# EAGLE schematic FinalSchV3 (EAGLE 7.5.0)
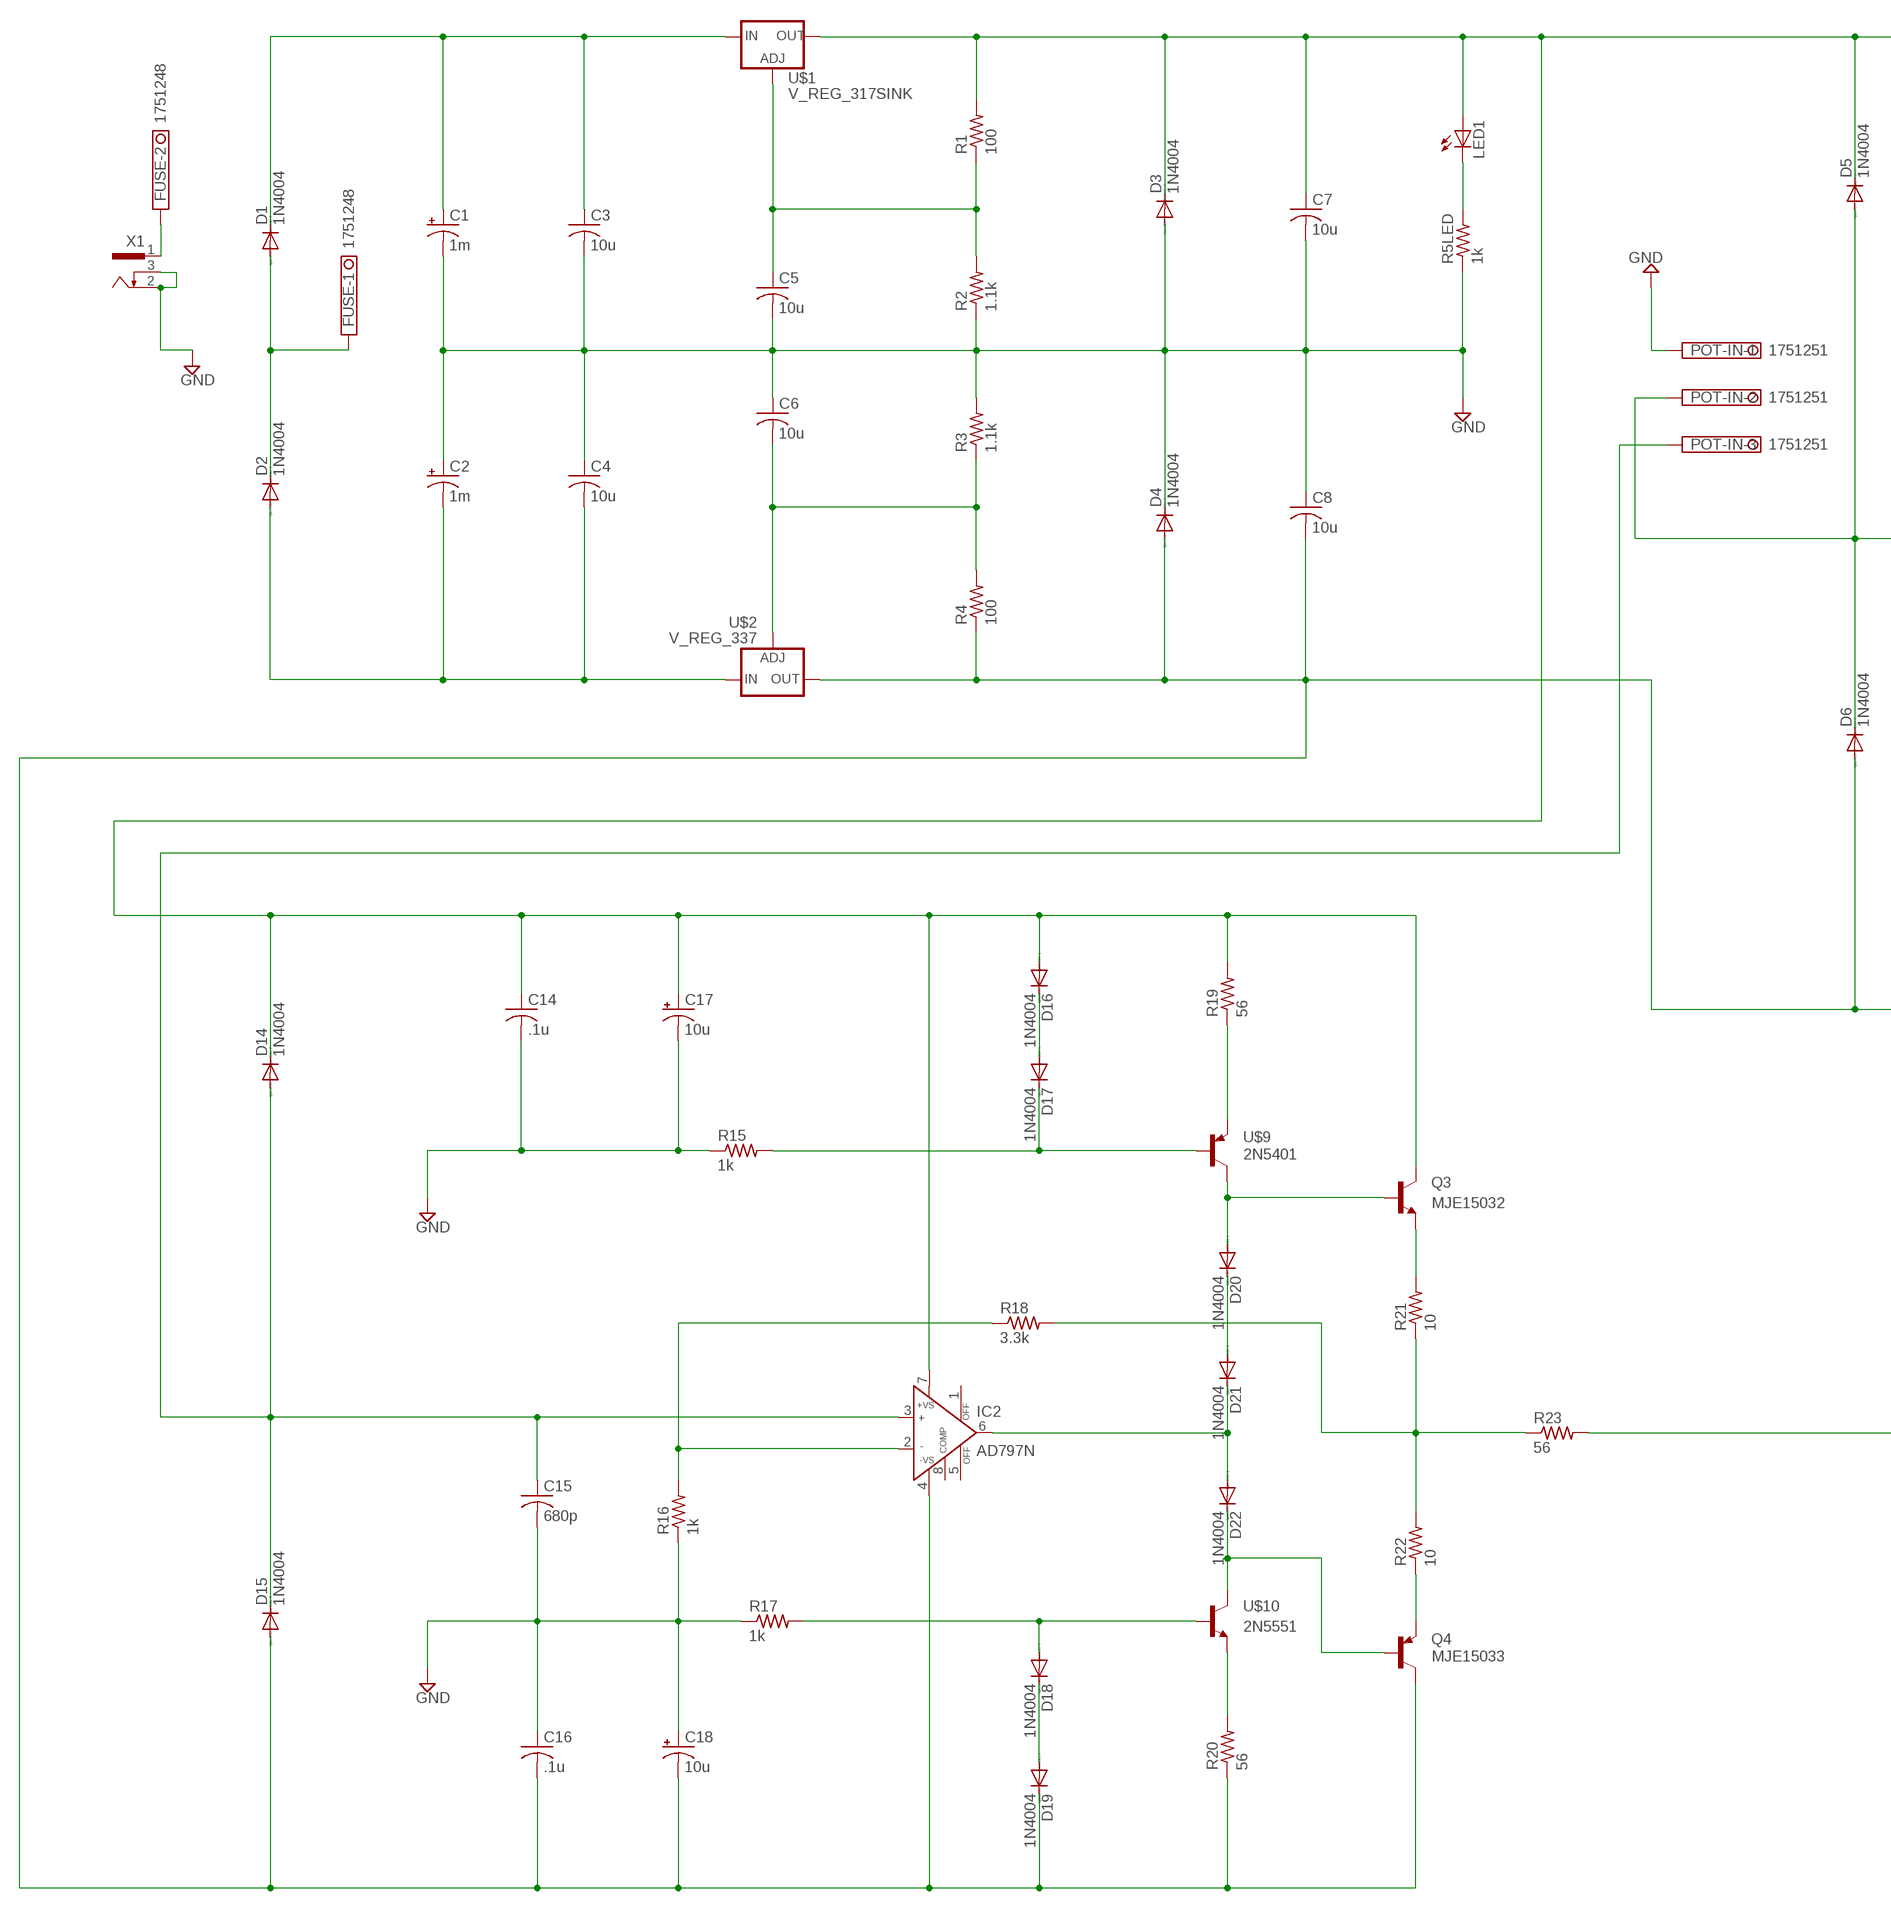
[diagram p0: schematic, sheet 1, part 1 of 2]
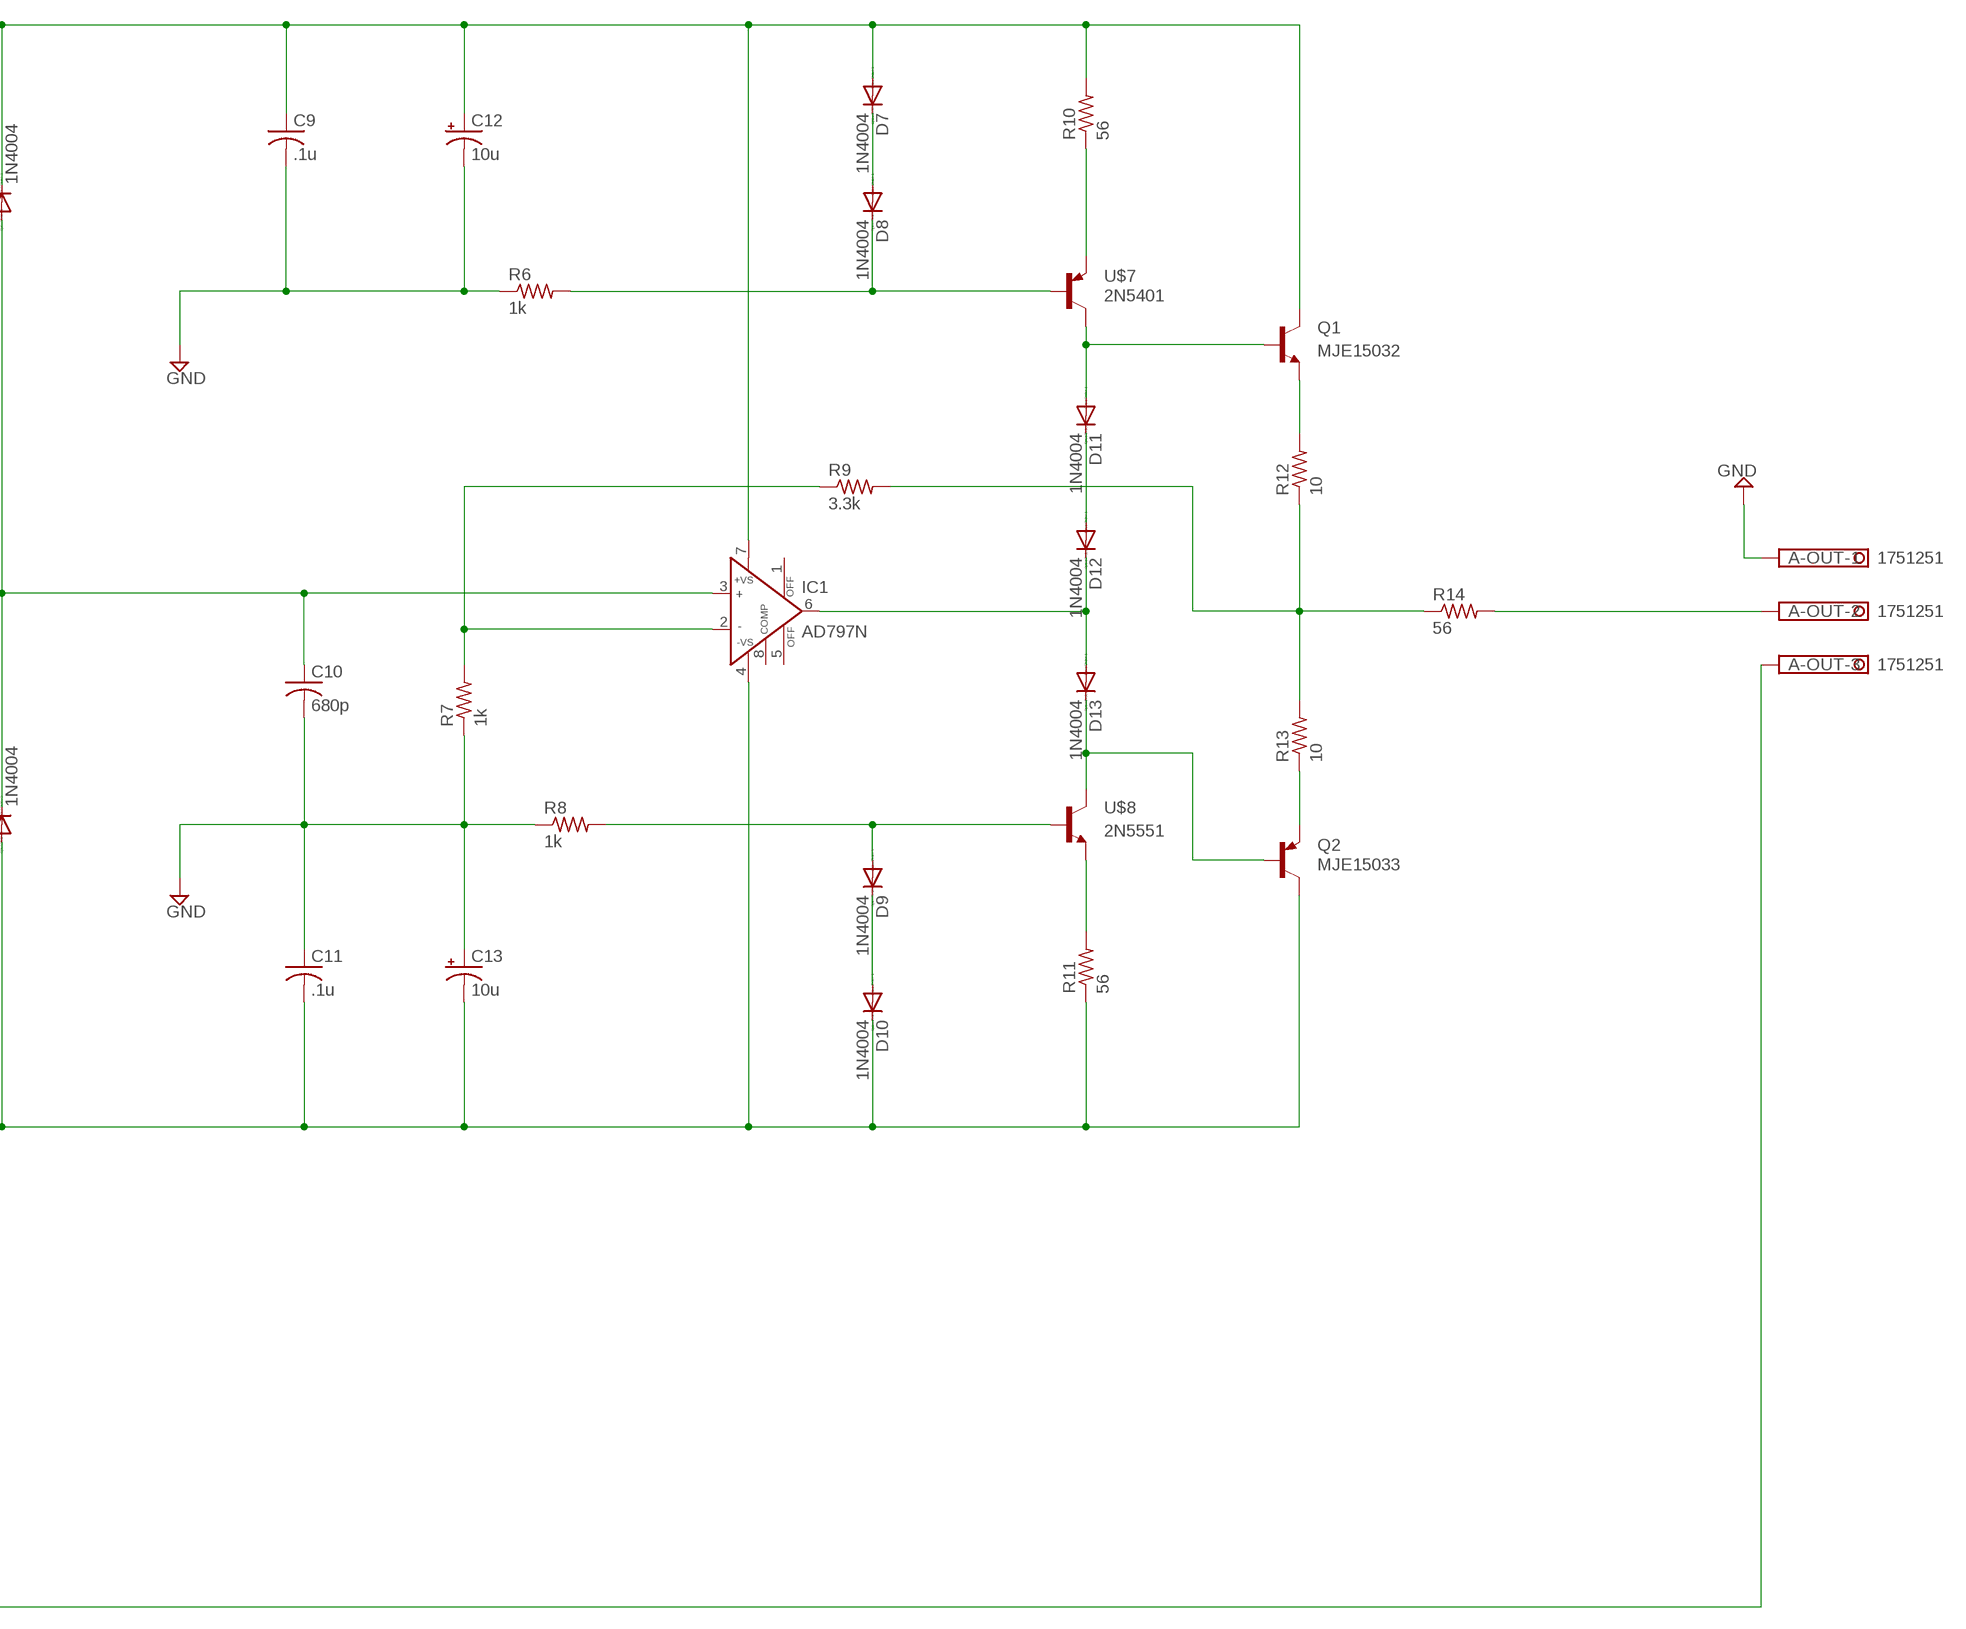
[diagram p1: schematic, sheet 1, part 2 of 2]

## Parts
A-OUT  1751251  [1751251]
C1  1m  CPOL-USE7.5-16  [E7,5-16]
C2  1m  CPOL-USE7.5-16  [E7,5-16]
C3  10u  C-US025-025X050  [C025-025X050]
C4  10u  C-US025-025X050  [C025-025X050]
C5  10u  C-US025-025X050  [C025-025X050]
C6  10u  C-US025-025X050  [C025-025X050]
C7  10u  C-US025-025X050  [C025-025X050]
C8  10u  C-US025-025X050  [C025-025X050]
C9  .1u  C-US025-024X044  [C025-024X044]
C10  680p  C-US025-024X044  [C025-024X044]
C11  .1u  C-US025-024X044  [C025-024X044]
C12  10u  CPOL-USE2-5  [E2-5]
C13  10u  CPOL-USE2-5  [E2-5]
C14  .1u  C-US025-024X044  [C025-024X044]
C15  680p  C-US025-024X044  [C025-024X044]
C16  .1u  C-US025-024X044  [C025-024X044]
C17  10u  CPOL-USE2-5  [E2-5]
C18  10u  CPOL-USE2-5  [E2-5]
D1  1N4004  [DO41-10]
D2  1N4004  [DO41-10]
D3  1N4004  [DO41-10]
D4  1N4004  [DO41-10]
D5  1N4004  [DO41-10]
D6  1N4004  [DO41-10]
D7  1N4004  [DO41-10]
D8  1N4004  [DO41-10]
D9  1N4004  [DO41-10]
D10  1N4004  [DO41-10]
D11  1N4004  [DO41-10]
D12  1N4004  [DO41-10]
D13  1N4004  [DO41-10]
D14  1N4004  [DO41-10]
D15  1N4004  [DO41-10]
D16  1N4004  [DO41-10]
D17  1N4004  [DO41-10]
D18  1N4004  [DO41-10]
D19  1N4004  [DO41-10]
D20  1N4004  [DO41-10]
D21  1N4004  [DO41-10]
D22  1N4004  [DO41-10]
FUSE  1751248  [1751248]
IC1  AD797N  [DIL08]
IC2  AD797N  [DIL08]
LED1  LED5MM  [LED5MM]
POT-IN  1751251  [1751251]
Q1  MJE15032  [TO220V]
Q2  MJE15033  [TO220V]
Q3  MJE15032  [TO220V]
Q4  MJE15033  [TO220V]
R1  100  R-US_0207/7  [0207/7]
R2  1.1k  R-US_0207/7  [0207/7]
R3  1.1k  R-US_0207/7  [0207/7]
R4  100  R-US_0207/7  [0207/7]
R5LED  1k  R-US_0207/7  [0207/7]
R6  1k  R-US_0207/7  [0207/7]
R7  1k  R-US_0207/7  [0207/7]
R8  1k  R-US_0207/7  [0207/7]
R9  3.3k  R-US_0207/7  [0207/7]
R10  56  R-US_0207/7  [0207/7]
R11  56  R-US_0207/7  [0207/7]
R12  10  R-US_0207/7  [0207/7]
R13  10  R-US_0207/7  [0207/7]
R14  56  R-US_0207/7  [0207/7]
R15  1k  R-US_0207/7  [0207/7]
R16  1k  R-US_0207/7  [0207/7]
R17  1k  R-US_0207/7  [0207/7]
R18  3.3k  R-US_0207/7  [0207/7]
R19  56  R-US_0207/7  [0207/7]
R20  56  R-US_0207/7  [0207/7]
R21  10  R-US_0207/7  [0207/7]
R22  10  R-US_0207/7  [0207/7]
R23  56  R-US_0207/7  [0207/7]
U$1  V_REG_317SINK  [TO220-ADJ]
U$2  V_REG_337  [TO220-ADJ-NEG]
U$7  2N5401  [2N5401]
U$8  2N5551  [2N5551]
U$9  2N5401  [2N5401]
U$10  2N5551  [2N5551]
X1  733980-62  [733980-62]

## Nets
GND [GND]: A-OUT.1 C9.2 C10.2 C11.1 C12.- C13.+ C14.2 C15.2 C16.1 C17.- C18.+ POT-IN.1 R6.1 R7.1 R8.1 R15.1 R16.1 R17.1
GPWR [GPWR]: C1.- C2.+ C3.2 C4.1 C5.2 C6.1 C7.2 C8.1 D3.A D4.C R2.1 R3.2 R5LED.1 X1.2 X1.3 ; supply symbol labelled GND
N$1: C1.+ C3.1 D1.C U$1.IN
N$2: D1.A D2.C FUSE.1
N$3: C2.- C4.2 D2.A U$2.IN
N$4: D7.C D8.A
N$5: A-OUT.2 R14.2
N$6: D8.C R6.2 U$7.B
N$7: A-OUT.3 R23.2
N$8: FUSE.2 X1.1
N$10: C6.2 R3.1 R4.2 U$2.ADJ
N$11: D11.A Q1.1(B) U$7.C
N$12: C5.1 R1.1 R2.2 U$1.ADJ
N$13: D16.C D17.A
N$14: D11.C D12.A
N$15: D12.C D13.A IC1.6(OUT)
N$16: LED1.K(C) R5LED.2
N$17: C10.1 D5.A D6.C IC1.3(IN+) POT-IN.2
N$18: D13.C Q2.1(B) U$8.C
N$19: R11.2 U$8.E
N$20: IC1.2(IN-) R7.2 R9.1
N$21: D17.C R15.2 U$9.B
N$22: D20.A Q3.1(B) U$9.C
N$23: D9.A R8.2 U$8.B
N$24: D9.C D10.A
N$25: D20.C D21.A
N$26: Q1.3(E) R12.2
N$27: R9.2 R12.1 R13.2 R14.1
N$28: Q2.3(E) R13.1
N$29: D21.C D22.A IC2.6(OUT)
N$30: D22.C Q4.1(B) U$10.C
N$31: R20.2 U$10.E
N$32: IC2.2(IN-) R16.2 R18.1
N$33: D18.A R17.2 U$10.B
N$34: D18.C D19.A
N$35: C15.1 D14.A D15.C IC2.3(IN+) POT-IN.3
N$36: Q3.3(E) R21.2
N$37: R18.2 R21.1 R22.2 R23.1
N$38: Q4.3(E) R22.1
N$39 [Minus]: C8.2 C11.2 C13.- C16.2 C18.- D4.A D6.A D10.C D15.A D19.C IC1.4(-VS) IC2.4(-VS) Q2.2(C) Q4.2(C) R4.1 R11.1 R20.1 U$2.OUT
Q1: R10.1 U$7.E
Q3 [Plus]: C7.1 C9.1 C12.+ C14.1 C17.+ D3.C D5.C D7.A D14.C D16.A IC1.7(+VS) IC2.7(+VS) LED1.A Q1.2(C) Q3.2(C) R1.2 R10.2 R19.2 U$1.OUT
Q4: R19.1 U$9.E
Unconnected: IC1.1(OFF) IC1.5(OFF) IC1.8(COMP) IC2.1(OFF) IC2.5(OFF) IC2.8(COMP)

## Library data of the parts
A-OUT POT-IN = con-phoenix-350:1751251: MKDS 1/ 3-3,5 Printklemme Nennstrom: 10 A Bemessungsspannung: 160 V Raster: 3,5 mm Polzahl: 3 Montageart: Löten Anschlussart: Schraubanschluss Anschlussrichtung vom Leiter zur Platine: 0° Source: http://eshop.phoenixcontact.com .. 1751251.pdf; OC_FARNELL: unknown; OC_NEWARK: unknown
C1 C2 C12 C13 C17 C18 = rcl:CPOL-US: POLARIZED CAPACITOR, American symbol
C3-C11 C14-C16 = rcl:C-US: CAPACITOR, American symbol
D1-D22 = diode:1N4004: DIODE general purpose rectifier, 1 A
FUSE = con-phoenix-350:1751248: MKDS 1/ 2-3,5 Printklemme Nennstrom: 10 A Bemessungsspannung: 160 V Raster: 3,5 mm Polzahl: 2 Montageart: Löten Anschlussart: Schraubanschluss Anschlussrichtung vom Leiter zur Platine: 0° Source: http://eshop.phoenixcontact.com .. 1751248.pdf; OC_FARNELL: unknown; OC_NEWARK: unknown
IC1 IC2 = analog-devices:AD797: Ultralow Distortion, Ultralow Noise Op Amp Source: http://www.analog.com/static/imported-files/data_sheets/AD797.pdf; MF: ALTERA CORPORATION; MPN: AD797ANZ; OC_FARNELL: 9603778; OC_NEWARK: 59K6088
LED1 = led:LED: LED OSRAM: - CHIPLED LG R971, LG N971, LY N971, LG Q971, LY Q971, LO R971, LY R971 LH N974, LH R974 LS Q976, LO Q976, LY Q976 LO Q996 - Hyper CHIPLED LW Q18S LB Q993, LB Q99A, LB R99A - SideLED LS A670, LO A670, LY A670, LG A670, LP A670 LB A673, LV A673, LT A673, LW A673 LH A674 LY A675 LS A676, LA A676, LO A676, LY A676, LW A676 LS A679, LY A679, LG A679 - Hyper Micro SIDELED® LS Y876, LA Y876, LO Y876, LY Y876 LT Y87S - SmartLED LW L88C, LW L88S LB L89C, LB L89S, LG L890 LS L89K, LO L89K, LY L89K LS L896, LA L896, LO L896, LY L896 - TOPLED LS T670, LO T670, LY T670, LG T670, LP T670 LSG T670, LSP T670, LSY T670, LOP T670, LYG T670 LG T671, LOG T671, LSG T671 LB T673, LV T673, LT T673, LW T673 LH T674 LS T676, LA T676, LO T676, LY T676, LB T676, LH T676, LSB T676, LW T676 LB T67C, LV T67C, LT T67C, LS T67K, LO T67K, LY T67K, LW E67C LS E67B, LA E67B, LO E67B, LY E67B, LB E67C, LV E67C, LT E67C LW T67C LS T679, LY T679, LG T679 LS T770, LO T770, LY T770, LG T770, LP T770 LB T773, LV T773, LT T773, LW T773 LH T774 LS E675, LA E675, LY E675, LS T675 LS T776, LA T776, LO T776, LY T776, LB T776 LHGB T686 LT T68C, LB T68C - Hyper Mini TOPLED® LB M676 - Mini TOPLED Santana® LG M470 LS M47K, LO M47K, LY M47K Source: http://www.osram.convergy.de LUXEON: - LUMILED® LXK2-PW12-R00, LXK2-PW12-S00, LXK2-PW14-U00, LXK2-PW14-V00 LXK2-PM12-R00, LXK2-PM12-S00, LXK2-PM14-U00 LXK2-PE12-Q00, LXK2-PE12-R00, LXK2-PE12-S00, LXK2-PE14-T00, LXK2-PE14-U00 LXK2-PB12-K00, LXK2-PB12-L00, LXK2-PB12-M00, LXK2-PB14-N00, LXK2-PB14-P00, LXK2-PB14-Q00 LXK2-PR12-L00, LXK2-PR12-M00, LXK2-PR14-Q00, LXK2-PR14-R00 LXK2-PD12-Q00, LXK2-PD12-R00, LXK2-PD12-S00 LXK2-PH12-R00, LXK2-PH12-S00 LXK2-PL12-P00, LXK2-PL12-Q00, LXK2-PL12-R00 Source: www.luxeon.com KINGBRIGHT: KA-3528ASYC Source: www.kingbright.com
Q1 Q3 = engr301-proj :MJE15032: NPN Power Transistor HF Audio Driver 8.0A, 250V, 50W
Q2 Q4 = engr301-proj :MJE15033: PNP Power Transistor HF Audio Driver 8.0A, 250V, 50W
R1-R4 R5LED R6-R23 = rcl:R-US_: RESISTOR, American symbol
U$1 = engr301-proj :V_REG_317: Voltage Regulator Standard LM317 adjustable voltage regulator. AOI (Adjust Output Input). Google 'LM317 Calculator' for easy to use app to get the two resistor values needed. 240/720 for 5V output. 240/390 for 3.3V output. Spark Fun Electronics SKU : COM-00527
U$2 = engr301-proj :V_REG_337: LM-337 Negative Adjustable Voltage Regulator
U$7 U$9 = engr301-proj :2N5401
U$8 U$10 = engr301-proj :2N5551
X1 = con-conrad:73398?: FEMALE PRINT CONNECTOR Niedervolt-Steckverbinder Distributor Conrad

## Net classes
1 Plus: width 0.305 mm, clearance 0.203 mm
2 Minus: width 0.305 mm, clearance 0.203 mm